# EAGLE design Wireless Flex Node (EAGLE 7.2.0)
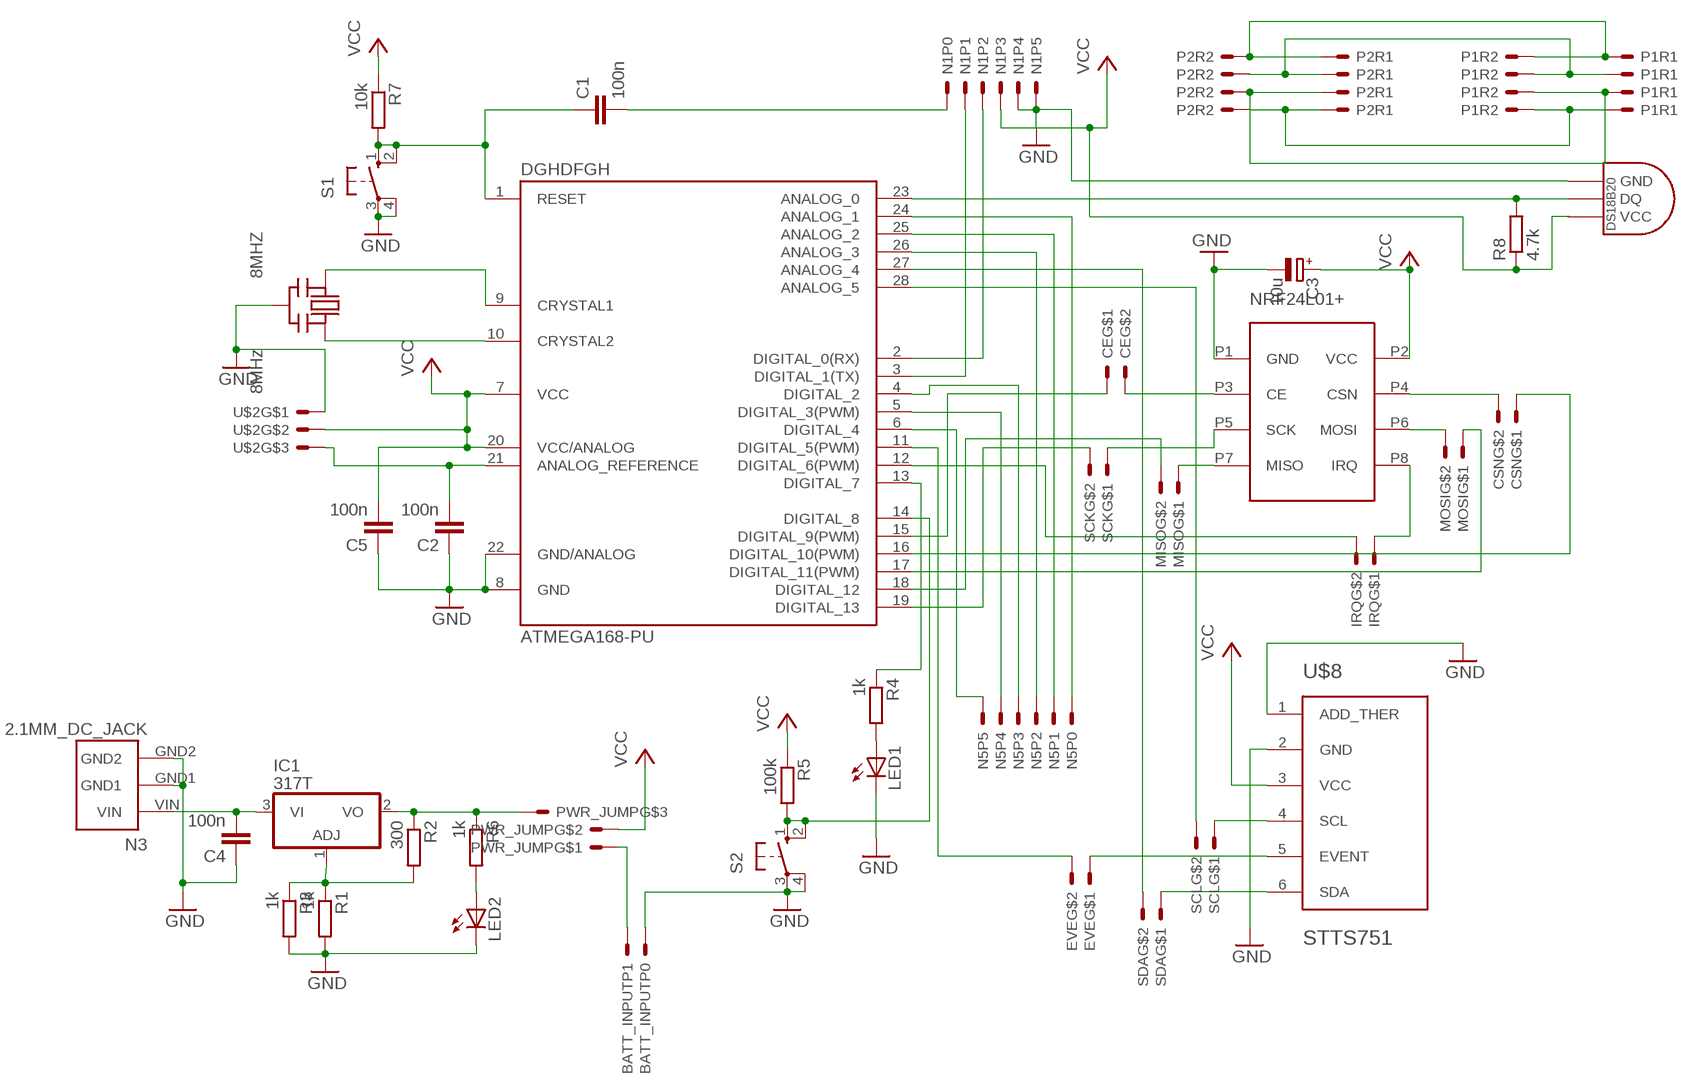
[diagram p0: schematic, sheet 1]

## Parts
8MHZ  8MHz  CERMOSCILL-THM  [CERM_OSC]
BATT_INPUT  2PINHEADER  [2PINHEADER]
C1  100n  C-EU050-030X075  [C050-030X075]
C2  100n  C-EU050-030X075  [C050-030X075]
C3  10u  CPOL-EUE2.5-6  [E2,5-6]
C4  100n  C-EU050-030X075  [C050-030X075]
C5  100n  C-EU050-030X075  [C050-030X075]
CE  2PINHEADER_S  [2PINHEADER_S]
CSN  2PINHEADER_S  [2PINHEADER_S]
DGHDFGH  ATMEGA168-PU  [DIL28-3]
EVE  2PINHEADER_S  [2PINHEADER_S]
IC1  317T  [TO220H]
IRQ  2PINHEADER_S  [2PINHEADER_S]
LED1  LED3MM  [LED3MM]
LED2  LED3MM  [LED3MM]
MISO  2PINHEADER_S  [2PINHEADER_S]
MOSI  2PINHEADER_S  [2PINHEADER_S]
N1  6PINHEADER  [6PINHEADER]
N3  2.1MM_DC_JACK  [2.1MM_DC_JACK]
N5  6PINHEADER  [6PINHEADER]
NRF24L01+  NRF24L01A  [NRF24L01]
P1  2X4_HEADER  [2X4_HEADER]
P2  2X4_HEADER  [2X4_HEADER]
PWR_JUMP  3PINHEADER  [3PINHEADER]
R1  1k  R-EU_0207/10  [0207/10]
R2  300  R-EU_0207/10  [0207/10]
R3  1k  R-EU_0207/10  [0207/10]
R4  1k  R-EU_0207/10  [0207/10]
R5  100k  R-EU_0207/10  [0207/10]
R6  1k  R-EU_0207/10  [0207/10]
R7  10k  R-EU_0207/10  [0207/10]
R8  4.7k  R-EU_0207/10  [0207/10]
S1  10-XX  [B3F-10XX]
S2  10-XX  [B3F-10XX]
SCK  2PINHEADER_S  [2PINHEADER_S]
SCL  2PINHEADER_S  [2PINHEADER_S]
SDA  2PINHEADER_S  [2PINHEADER_S]
U$2  3PINHEADER  [3PINHEADER]
U$8  STTS751  [STTS751-SOT23-6L]
U$9  DS1820TO92  [DS1820]

## Nets
GND: 8MHZ.P$2(GND) BATT_INPUT.P0 C2.1 C3.- C4.1 C5.1 DGHDFGH.8(GND) DGHDFGH.22(GND/ANALOG) LED1.K(C) LED2.K(C) N1.P4 N1.P5 N3.GND1 N3.GND2 NRF24L01+.P1(GND) R1.2 R3.2 S1.3(P) S1.4(P1) S2.3(P) S2.4(P1) U$2.N0 U$8.1(ADD_THER) U$8.2(GND) U$9.GND
N$1: MISO.N0 NRF24L01+.P7(MISO)
N$2: DGHDFGH.18(DIGITAL_12) MISO.N1
N$3: DGHDFGH.19(DIGITAL_13) SCK.N1
N$4: NRF24L01+.P5(SCK) SCK.N0
N$5: MOSI.N1 NRF24L01+.P6(MOSI)
N$6: DGHDFGH.17(DIGITAL_11(PWM)) MOSI.N0
N$7: CE.N1 NRF24L01+.P3(CE)
N$8: CSN.N0 DGHDFGH.16(DIGITAL_10(PWM))
N$9: CSN.N1 NRF24L01+.P4(CSN)
N$10: CE.N0 DGHDFGH.15(DIGITAL_9(PWM))
N$11: DGHDFGH.13(DIGITAL_7) R4.1
N$12: C1.2 N1.P0
N$13: 8MHZ.P$1(IN) DGHDFGH.9(CRYSTAL1)
N$14: 8MHZ.P$3(OUT) DGHDFGH.10(CRYSTAL2)
N$15: C1.1 DGHDFGH.1(RESET) R7.2 S1.1(S) S1.2(S1)
N$16: DGHDFGH.14(DIGITAL_8) R5.2 S2.1(S) S2.2(S1)
N$17: LED1.A R4.2
N$18: IRQ.N0 NRF24L01+.P8(IRQ)
N$19: DGHDFGH.3(DIGITAL_1(TX)) N1.P1
N$20: DGHDFGH.2(DIGITAL_0(RX)) N1.P2
N$21: C2.2 DGHDFGH.21(ANALOG_REFERENCE) U$2.N2
N$22: DGHDFGH.12(DIGITAL_6(PWM)) IRQ.N1
N$23: DGHDFGH.6(DIGITAL_4) N5.P5
N$24: DGHDFGH.23(ANALOG_0) R8.2 U$9.DQ
N$25: DGHDFGH.5(DIGITAL_3(PWM)) N5.P4
N$26: SCL.N0 U$8.4(SCL)
N$27: DGHDFGH.28(ANALOG_5) SCL.N1
N$28: SDA.N0 U$8.6(SDA)
N$29: DGHDFGH.27(ANALOG_4) SDA.N1
N$30: EVE.N0 U$8.5(EVENT)
N$31: DGHDFGH.11(DIGITAL_5(PWM)) EVE.N1
N$32: C4.2 IC1.3(VI) N3.VIN
N$33: IC1.1(ADJ) R1.1 R2.2 R3.1
N$34: IC1.2(VO) PWR_JUMP.N2 R2.1 R6.1
N$35: BATT_INPUT.P1 PWR_JUMP.N0
N$36: LED2.A R6.2
N$37: DGHDFGH.4(DIGITAL_2) N5.P3
N$38: DGHDFGH.26(ANALOG_3) N5.P2
N$39: DGHDFGH.25(ANALOG_2) N5.P1
N$40: DGHDFGH.24(ANALOG_1) N5.P0
N$88: P1.P1(R1:S) P1.P5(R2:S) P2.P1(R1:S) P2.P5(R2:S)
N$89: P1.P2(R1:S1) P1.P6(R2:S1) P2.P2(R1:S1) P2.P6(R2:S1)
N$90: P1.P3(R1:S2) P1.P7(R2:S2) P2.P3(R1:S2) P2.P7(R2:S2)
N$91: P1.P4(R1:S3) P1.P8(R2:S3) P2.P4(R1:S3) P2.P8(R2:S3)
VCC: C3.+ C5.2 DGHDFGH.7(VCC) DGHDFGH.20(VCC/ANALOG) N1.P3 NRF24L01+.P2(VCC) PWR_JUMP.N1 R5.1 R7.1 R8.1 U$2.N1 U$8.3(VCC)

## Power pins joined to a net without a drawn wire
VCC: U$9.VDD(VCC)

## Library data of the parts
8MHZ = adafruit:CERMOSCILL: Ceramic oscillator with built in capacitors such as ZTT-12MHz http://www.ladyada.net/library/eagle
BATT_INPUT = ForceTronics:2PINHEADER
C1 C2 C4 C5 = rcl:C-EU: CAPACITOR, European symbol
C3 = rcl:CPOL-EU: POLARIZED CAPACITOR, European symbol
CE CSN EVE IRQ MISO MOSI SCK SCL SDA = ForceTronics:2PINHEADER_S: 2 pin header with round copper
DGHDFGH = Arduino-AVR:ATMEGA168-PU
IC1 = linear:*317: Positive VOLTAGE REGULATOR
LED1 LED2 = adafruit:LED: LED OSRAM: - CHIPLED LG R971, LG N971, LY N971, LG Q971, LY Q971, LO R971, LY R971 LH N974, LH R974 LS Q976, LO Q976, LY Q976 LO Q996 - Hyper CHIPLED LW Q18S LB Q993, LB Q99A, LB R99A - SideLED LS A670, LO A670, LY A670, LG A670, LP A670 LB A673, LV A673, LT A673, LW A673 LH A674 LY A675 LS A676, LA A676, LO A676, LY A676, LW A676 LS A679, LY A679, LG A679 - Hyper Micro SIDELEDÂ® LS Y876, LA Y876, LO Y876, LY Y876 LT Y87S - SmartLED LW L88C, LW L88S LB L89C, LB L89S, LG L890 LS L89K, LO L89K, LY L89K LS L896, LA L896, LO L896, LY L896 - TOPLED LS T670, LO T670, LY T670, LG T670, LP T670 LSG T670, LSP T670, LSY T670, LOP T670, LYG T670 LG T671, LOG T671, LSG T671 LB T673, LV T673, LT T673, LW T673 LH T674 LS T676, LA T676, LO T676, LY T676, LB T676, LH T676, LSB T676, LW T676 LB T67C, LV T67C, LT T67C, LS T67K, LO T67K, LY T67K, LW E67C LS E67B, LA E67B, LO E67B, LY E67B, LB E67C, LV E67C, LT E67C LW T67C LS T679, LY T679, LG T679 LS T770, LO T770, LY T770, LG T770, LP T770 LB T773, LV T773, LT T773, LW T773 LH T774 LS E675, LA E675, LY E675, LS T675 LS T776, LA T776, LO T776, LY T776, LB T776 LHGB T686 LT T68C, LB T68C - Hyper Mini TOPLEDÂ® LB M676 - Mini TOPLED SantanaÂ® LG M470 LS M47K, LO M47K, LY M47K Source: http://www.osram.convergy.de/
N1 N5 = ForceTronics:6PINHEADER
N3 = ForceTronics:2.1MM_DC_JACK: Male DC Jack 2.1mm
NRF24L01+ = ForceTronics:NRF24L01
P1 P2 = ForceTronics:2X4_HEADER: 2 x 4 Female Pin Header, Spacing is .1"
PWR_JUMP U$2 = ForceTronics:3PINHEADER: 3 pin header with oval copper
R1-R8 = rcl:R-EU_: RESISTOR, European symbol
S1 S2 = switch-omron:10-XX: OMRON SWITCH; MPN: B3F-1000; OC_FARNELL: 176432; OC_NEWARK: 36M3542
U$8 = ForceTronics:STTS751: STTS751 Temperature sensor with SOT23-6L package
U$9 = Ava:DS1820: DS18B20 Programmable Resolution 1-Wire Digital Thermometer Description The DS18B20 digital thermometer provides 9-bit to 12-bit Celsius temperature measurements and has an alarm function with nonvolatile user-programmable upper and lower trigger points. The DS18B20 communicates over a 1-WireÂ® bus that by definition requires only one data line (and ground) for communication with a central microprocessor. It has an operating temperature range of -55Â°C to +125Â°C and is accurate to Â±0.5Â°C over the range of -10Â°C to +85Â°C. In addition, the DS18B20 can derive power directly from the data line ("parasite power"), eliminating the need for an external power supply. Each DS18B20 has a unique 64-bit serial code, which allows multiple DS18B20s to function on the same 1-Wire bus. Thus, it is simple to use one microprocessor to control many DS18B20s distributed over a large area. Applications that can benefit from this feature include HVAC environmental controls, temperature monitoring systems inside buildings, equipment, or machinery, and process monitoring and control systems.

## Board
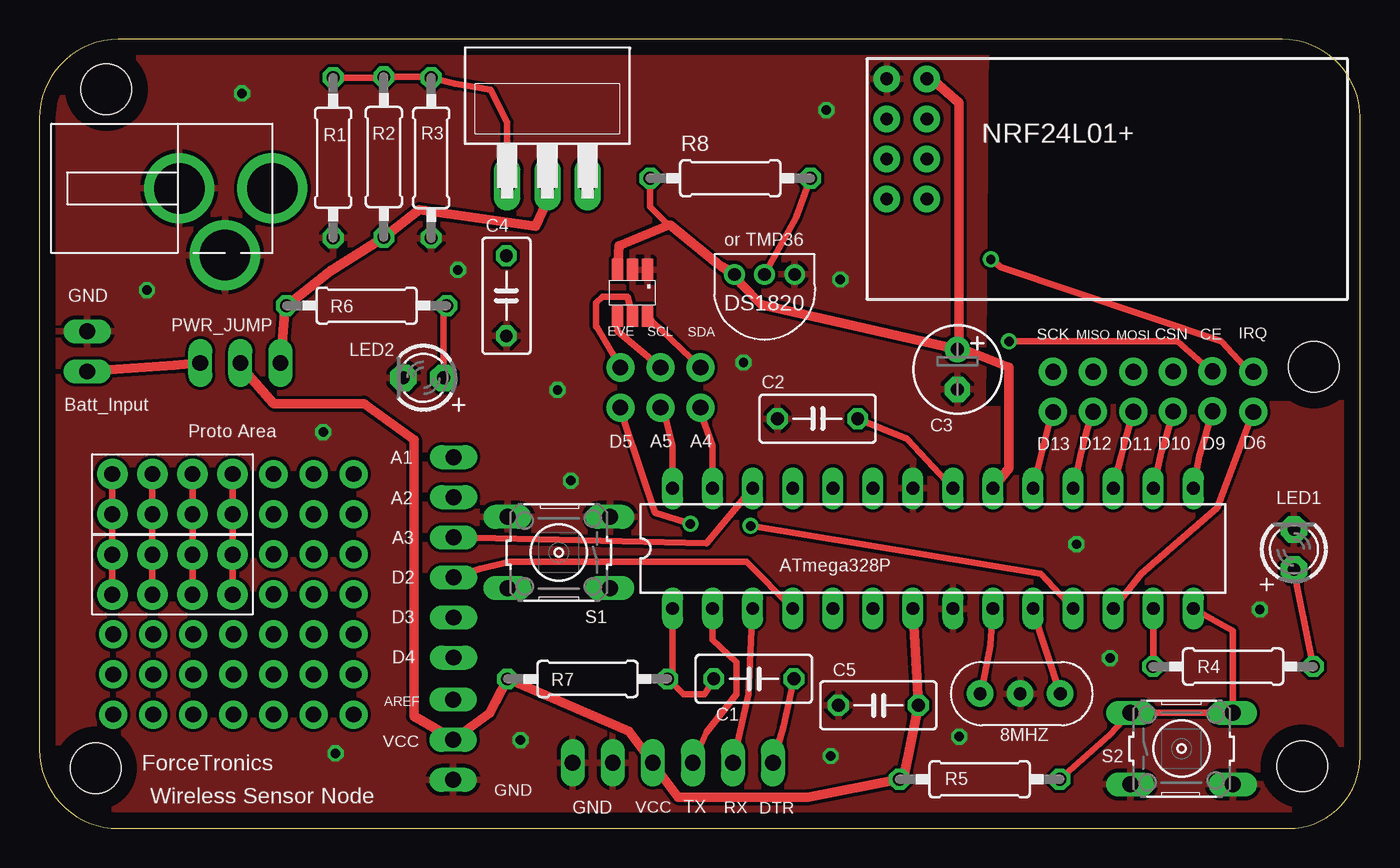
[diagram p1: board, top side]
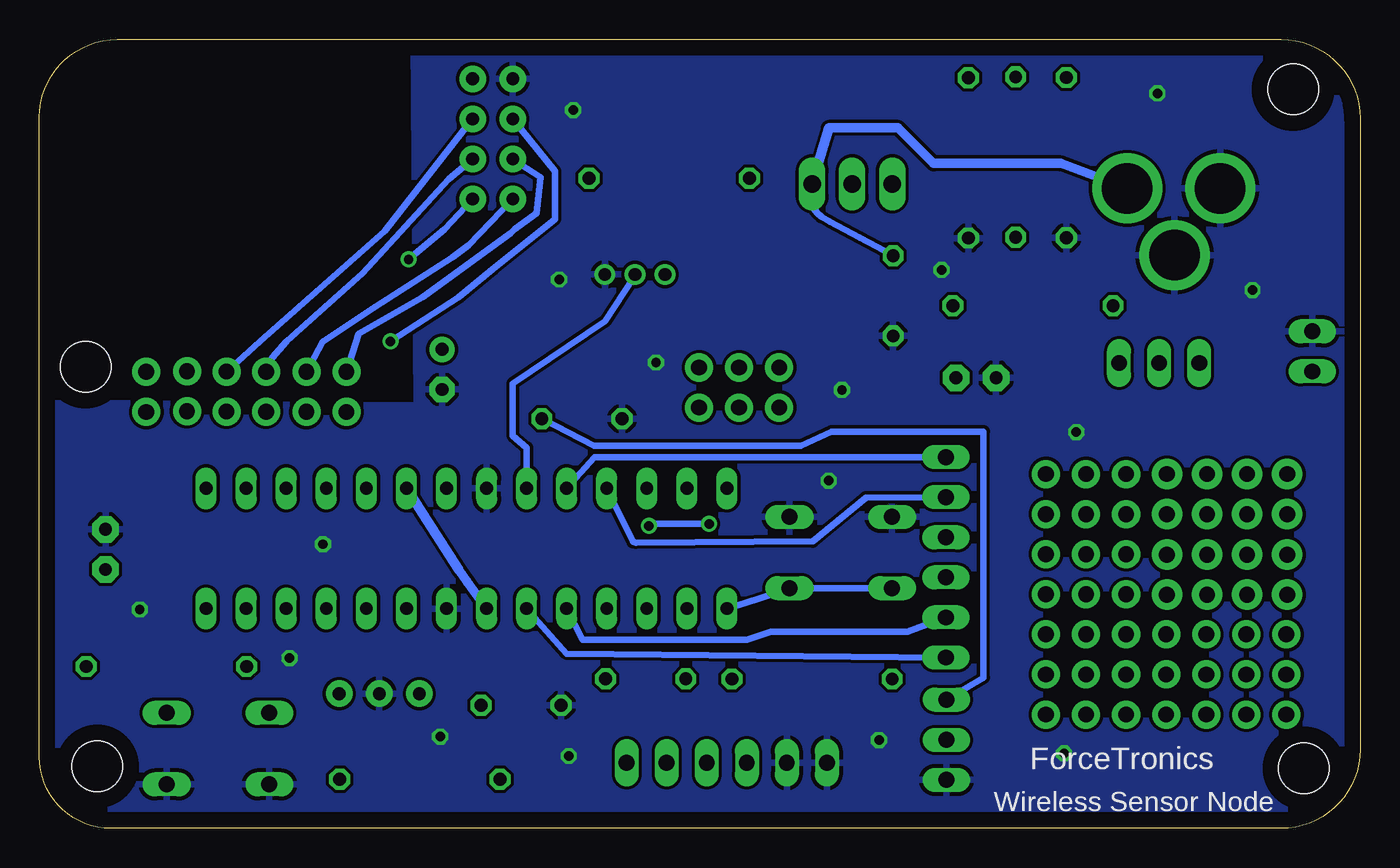
[diagram p2: board, bottom side, seen from below]

Size 83.73 x 50 mm. Coordinates in mm from the lower left corner, seen from the top.
Outline: 0,45 0,5 arc90 5,0 79.2,0 arc90 83.73,4.53 83.73,45.07 arc90 78.8,50 5,50 arc90 0,45
Copper layers (1*16): Top 0.035mm / dielectric 1.5mm / Bottom 0.035mm
Design rules "default": minimum track width 10mil, minimum drill 24mil, track to track 8mil, track to pad 8mil, pad to pad 8mil, via to via 8mil, smd to smd 8mil, copper to edge 40mil, drill to drill 8mil, minimum pad ring 10mil, minimum via ring 8mil, stop-mask expansion 4mil, vias tented up to drill 0mil, thermal gap 10mil
Holes 3.2 mm at 4.24,46.84 3.56,3.81 80.06,3.94 80.8,29.25

### Footprints (pad centres in the part's own frame; a part is rotated, then mirrored left to right if it is on the bottom)
CERM_OSC = drill 0.813 pad 1.676: P$1 -2.54,0; P$2 0,0; P$3 2.54,0
2PINHEADER = drill 1 long: P0 -1.27,0; P1 1.27,0
C050-030X075 = drill 0.813 octagon: 1 -2.54,0; 2 2.54,0
E2,5-6 = drill 0.813 pad 1.6: + -1.27,0 | drill 0.813 pad 1.6 octagon: - 1.27,0
2PINHEADER_S = drill 1 pad 1.778: N0 1.27,2.54; N1 3.81,2.54; N2 1.27,2.54
DIL28-3 = drill 0.813 long: 1 -16.51,-3.81; 2 -13.97,-3.81; 3 -11.43,-3.81; 4 -8.89,-3.81; 5 -6.35,-3.81; 6 -3.81,-3.81; 7 -1.27,-3.81; 8 1.27,-3.81; 9 3.81,-3.81; 10 6.35,-3.81; 11 8.89,-3.81; 12 11.43,-3.81; 13 13.97,-3.81; 14 16.51,-3.81; 15 16.51,3.81; 16 13.97,3.81; 17 11.43,3.81; 18 8.89,3.81; 19 6.35,3.81; 20 3.81,3.81; 21 1.27,3.81; 22 -1.27,3.81; 23 -3.81,3.81; 24 -6.35,3.81; 25 -8.89,3.81; 26 -11.43,3.81; 27 -13.97,3.81; 28 -16.51,3.81
TO220H = drill 1.118 long: 1 -2.54,-10.16; 2 0,-10.16; 3 2.54,-10.16
LED3MM = drill 0.813 pad 1.676 octagon: A -1.27,0; K 1.27,0
6PINHEADER = drill 1 long: P0 1.27,-1.778; P1 3.81,-1.778; P2 6.35,-1.778; P3 8.89,-1.778; P4 11.43,-1.778; P5 13.97,-1.778
2.1MM_DC_JACK = drill 3.2 pad 4.445: GND1 4.1,8.1; GND2 8.327,11; VIN 4.1,14
NRF24L01 = drill 0.8 pad 1.676: P1 13.97,-1.27; P2 13.97,-3.81; P3 11.43,-1.27; P4 11.43,-3.81; P5 8.89,-1.27; P6 8.89,-3.81; P7 6.35,-1.27; P8 6.35,-3.81
2X4_HEADER = drill 1 pad 1.93: P1 1.27,3.81; P2 3.81,3.81; P3 6.35,3.81; P4 8.89,3.81; P5 1.27,1.27; P6 3.81,1.27; P7 6.35,1.27; P8 8.89,1.27
3PINHEADER = drill 1 long: N0 1.27,1.27; N1 3.81,1.27; N2 6.35,1.27
0207/10 = drill 0.813 octagon: 1 -5.08,0; 2 5.08,0
B3F-10XX = drill 1.016 long: 1 -3.251,2.261; 2 3.251,2.261; 3 -3.251,-2.261; 4 3.251,-2.261
STTS751-SOT23-6L = smd 1.4 x 0.7: 1 -0.65,2.4; 2 -0.65,1.45; 3 -0.65,0.5; 4 2.25,0.5; 5 2.25,1.45; 6 2.25,2.4
DS1820 = drill 0.8: DQ 2.54,-1.27; GND 0.635,-1.27; VDD 4.445,-1.27

### Placement (x,y rotation side)
8MHZ  62.18,8.54 0 top
BATT_INPUT  3.02,30.23 270 top
C1  45.29,9.48 0 top
C2  49.33,25.96 0 top
C3  58.2,29.09 270 top
C4  29.61,33.75 90 top
C5  53.19,7.8 0 top
CE  76.91,25.17 90 top
CSN  74.41,25.14 90 top
DGHDFGH  56.65,17.74 0 top
EVE  34.29,30.48 270 top
IC1  32.2,51 0 top
IRQ  74.42,30.2 270 top
LED1  79.54,17.68 90 top
LED2  24.35,28.55 180 top
MISO  64.26,30.21 270 top
MOSI  71.9,25.14 90 top
N1  47.77,2.38 180 top
N3  0.76,44.66 270 top
N5  28.04,24.8 270 top
NRF24L01+  52.46,33.54 90 top
P1  3.35,18.64 0 top
P2  3.35,13.54 0 top
PWR_JUMP  8.93,28.23 0 top
R1  18.62,42.5 270 top
R2  21.84,42.55 90 top
R3  24.84,42.49 270 top
R4  75.68,10.26 0 top
R5  59.61,3.11 0 top
R6  20.74,33.13 0 top
R7  34.75,9.47 0 top
R8  43.8,41.2 0 top
S1  32.93,17.48 180 top
S2  72.41,5.05 0 top
SCK  61.72,30.2 270 top
SCL  36.83,30.48 270 top
SDA  39.37,30.48 270 top
U$2  27.5,1.8 90 top
U$8  36.14,34.75 270 top
U$9  48.51,33.83 180 top

### Tracks (layer width: path | path; a pad name or v marks a point on that pad's centre or on a via)
GND  (via drill 0.6)
  other vias: 18.77,4.75 17.99,25.11 6.81,34.11 12.85,46.58 26.54,35.4 30.5,5.59 33.69,22.03 32.85,27.79 44.64,29.52 50.78,34.78 49.89,45.52 50.17,4.58 58.32,5.82 67.88,10.79 65.75,18.01 77.37,13.87
  pour Bottom: 79,-1 6,-1 arc-90 0,5 0,45 arc-90 5,50 60,50 59.82,26.82 85,27 85,5 arc-90
  pour Top: 85,27 85,0.92 arc-90 80,-1.54 5,0 arc-90 0,5 0,45 arc-90 5,50 60,50 59.82,26.57
GND1  (via drill 1 pad 1.78)
  other vias: 4.67,9.75
GND2  (via drill 1 pad 1.78)
  other vias: 4.67,7.21
N$1
  Bottom 0.406: MISO.N0 65.79,30.85 62.48,33.02 57.53,36.2 56.52,36.96 NRF24L01+.P7
N$2
  Top 0.406: MISO.N1 66.45,25.32 66.05,23.88 DGHDFGH.18
N$3
  Top 0.406: SCK.N1 64.04,25.73 DGHDFGH.19
N$4
  Bottom 0.406: SCK.N0 63.5,31.35 59.44,33.66 53.85,37.72 53.59,37.97 52.2,38.99 51.94,41.27 53.73,42.42 NRF24L01+.P5
N$5
  Bottom 0.406: MOSI.N1 68.96,29.84 68.07,30.86 63.25,35.18 57.78,41.15 56.27,42.42 NRF24L01+.P6
N$6
  Top 0.406: DGHDFGH.17 68.58,23.62 68.86,24.64 MOSI.N0
N$7  (via drill 0.6)
  Top 0.406: CE.N1 74.3,28.98 72.14,30.86 v61.47,30.86
  Bottom 0.406: v61.47,30.86 57.15,33.66 54.99,35.43 51.05,38.61 51.05,41.66 53.73,44.96 NRF24L01+.P3
N$8
  Top 0.406: CSN.N0 71.88,26.41 71.37,24.64 71.13,23.88 DGHDFGH.16
N$9
  Bottom 0.406: CSN.N1 69.72,30.86 61.85,37.85 56.27,44.96 NRF24L01+.P4
N$10
  Top 0.406: DGHDFGH.15 73.53,23.62 73.86,24.64 CE.N0
N$11
  Top 0.406: R4.1 70.62,10.26 DGHDFGH.13
N$12
  Top 0.406: N1.P0 47.17,6.45 C1.2
N$13
  Top 0.406: 8MHZ.P$1 59.69,8.54 60.25,11.4 60.28,11.63 DGHDFGH.9
N$14
  Top 0.406: DGHDFGH.10 62.94,13.98 62.94,13.89 64.72,8.51 8MHZ.P$3
N$15
  Top 0.406: C1.1 42.8,9.48 42.16,8.51 40.84,8.51 R7.2 40.14,9.98 DGHDFGH.1
  Bottom 0.406: DGHDFGH.1 38.13,14.54 S1.1 S1.2
N$16
  Top 0.406: DGHDFGH.14 75.66,12.53 S2.2 S2.1 67.86,5.92 R5.2
N$17
  Top 0.406: R4.2 80.77,10.26 79.88,14.61 79.54,16.38 LED1.A
N$18  (via drill 0.6)
  Top 0.406: IRQ.N0 76.71,28.93 74.93,30.86 60.96,35.56 v60.33,36.07
  Bottom 0.406: v60.33,36.07 58.04,37.97 NRF24L01+.P8
N$19
  Top 0.406: N1.P1 44.97,8.5 DGHDFGH.3
N$20
  Top 0.406: N1.P2 42.29,6.09 42.29,6.1 44.2,8.51 44.2,10.54 42.68,11.94 DGHDFGH.2
N$21
  Top 0.406: C2.2 55,24.69 DGHDFGH.21
  Bottom 0.406: U$2.N2 23.88,9.55 23.88,25.15 33.53,25.15 35.43,24.26 48.57,24.26 C2.2
N$22
  Top 0.406: IRQ.N1 74.68,20.32 69.86,16.13 DGHDFGH.12
N$23
  Bottom 0.406: N5.P5 50.3,11.08 DGHDFGH.6
N$24
  Top 0.406: R8.2 47.98,38.71 U$9.DQ
  Bottom 0.406: U$9.DQ 46.07,34.9 47.88,32.13 53.72,28.19 53.72,24.89 52.84,24.13 DGHDFGH.23
N$25
  Bottom 0.406: N5.P4 26.92,13.11 28.7,12.45 37.34,12.45 38.86,11.94 49.28,11.94 DGHDFGH.5
N$26
  Top 0.406: U$8.4 36.7,32.3 36.58,32.38 36.66,31.5 SCL.N0
N$27
  Top 0.406: SCL.N1 39.75,25.78 40.14,24.26 DGHDFGH.28
N$28
  Top 0.406: U$8.6 38.84,32.14 SDA.N0
N$29
  Top 0.406: SDA.N1 41.94,26.64 42.04,26.04 42.68,24.26 DGHDFGH.27
N$30
  Top 0.406: EVE.N0 35.35,31.76 35.35,31.75 35.3,31.8 35.3,33.3 35.7,33.7 37.29,33.7 U$8.5
N$31  (via drill 0.6)
  Top 0.406: EVE.N1 37.13,25.63 39.04,20.02 v41.27,19.3 | v45.09,19.18 63.51,16.13 DGHDFGH.11
  Bottom 0.406: v41.27,19.3 45.09,19.3 v45.09,19.18
N$32
  Bottom 0.406: C4.2 29.61,36.32 31.71,37.45 33.62,38.46 34.16,38.76 34.4,39 34.8,39.48 IC1.3
  Bottom 0.61: N3.VIN 18.97,42.15 27.05,42.15 29.3,44.4 33.68,44.4 IC1.3
N$33
  Top 0.406: R1.1 21.84,47.58 R2.2 24.84,47.62 R3.1 26.36,47.19 26.95,47.1 28.6,46.8 29.66,44.74 IC1.1
N$34
  Top 0.406: R2.1 | 18.41,35.31 18.58,35.43
  Top 0.61: 18.41,35.31 R2.1 24.08,39.2 31.44,38.16 32.1,39.52 IC1.2 | 18.58,35.43 R6.1 15.53,32.75 PWR_JUMP.N2
N$35
  Top 0.61: BATT_INPUT.P1 8.55,29.34 PWR_JUMP.N0
N$36
  Top 0.406: R6.2 25.62,33.13 LED2.A
N$37
  Top 0.406: N5.P3 27.94,16.46 29.84,16.89 44.84,16.89 DGHDFGH.4
N$38
  Top 0.406: N5.P2 42.3,18.07 DGHDFGH.26
N$39
  Bottom 0.406: DGHDFGH.25 46.11,18.16 45.91,18.11 34.7,18.19 31.34,20.96 N5.P1
N$40
  Bottom 0.406: N5.P0 48.52,23.53 DGHDFGH.24
N$45  (via drill 1 pad 1.78)
  other vias: 14.83,22.45
N$46  (via drill 1 pad 1.78)
  other vias: 17.37,22.45
N$47  (via drill 1 pad 1.78)
  other vias: 19.91,22.45
N$52  (via drill 1 pad 1.78)
  other vias: 14.83,19.91
N$53  (via drill 1 pad 1.78)
  other vias: 17.37,19.91
N$54  (via drill 1 pad 1.78)
  other vias: 19.91,19.91
N$59  (via drill 1 pad 1.78)
  other vias: 14.83,17.37
N$60  (via drill 1 pad 1.78)
  other vias: 17.37,17.37
N$61  (via drill 1 pad 1.78)
  other vias: 19.91,17.37
N$62  (via drill 1 pad 1.78)
  other vias: 19.91,14.83
N$63  (via drill 1 pad 1.78)
  other vias: 17.37,14.83
N$64  (via drill 1 pad 1.78)
  other vias: 14.83,14.83
N$69  (via drill 1 pad 1.78)
  other vias: 4.67,12.29
N$70  (via drill 1 pad 1.78)
  other vias: 7.21,12.29
N$71  (via drill 1 pad 1.78)
  other vias: 9.75,12.29
N$72  (via drill 1 pad 1.78)
  other vias: 12.29,12.29
N$73  (via drill 1 pad 1.78)
  other vias: 14.83,12.29
N$74  (via drill 1 pad 1.78)
  other vias: 17.37,12.29
N$75  (via drill 1 pad 1.78)
  other vias: 19.91,12.29
N$76  (via drill 1 pad 1.78)
  other vias: 19.91,9.75
N$77  (via drill 1 pad 1.78)
  other vias: 17.37,9.75
N$78  (via drill 1 pad 1.78)
  other vias: 14.83,9.75
N$79  (via drill 1 pad 1.78)
  other vias: 12.29,9.75
N$80  (via drill 1 pad 1.78)
  other vias: 9.75,9.75
N$81  (via drill 1 pad 1.78)
  other vias: 7.21,9.75
N$82  (via drill 1 pad 1.78)
  other vias: 19.91,7.21
N$83  (via drill 1 pad 1.78)
  other vias: 17.37,7.21
N$84  (via drill 1 pad 1.78)
  other vias: 14.83,7.21
N$85  (via drill 1 pad 1.78)
  other vias: 12.29,7.21
N$86  (via drill 1 pad 1.78)
  other vias: 9.75,7.21
N$87  (via drill 1 pad 1.78)
  other vias: 7.21,7.21
N$88
  Top 0.406: P1.P1 P1.P5 P2.P1 P2.P5
N$89
  Top 0.406: P1.P2 P1.P6 P2.P2 P2.P6
N$90
  Top 0.406: P1.P3 P1.P7 P2.P3 P2.P7
N$91
  Top 0.406: P1.P4 P1.P8 P2.P4 P2.P8
VCC
  Top 0.406: 26.16,5.71 U$2.N1 | N1.P3 38.91,4.11 | 55.73,7.75 C5.2 | PWR_JUMP.N1 12.57,29.5 | 20.7,26.92 20.57,26.92 | R8.1 38.72,39.41 39.9,38.23
  Top 0.61: 26.16,5.71 23.75,7.11 23.75,24.64 20.57,26.92 14.86,26.92 12.57,29.5 | U$2.N1 28.52,7.29 R7.1 37.39,6.17 N1.P3 | 38.91,4.11 40.49,1.98 48.71,1.98 R5.1 54.84,3.42 55.6,7.16 55.73,7.75 | DGHDFGH.20 61.47,22.82 61.47,29.21 58.29,30.48 | U$8.3 36.74,36.93 39.9,38.23 40.01,38.23 42.96,35.8 43.27,35.6 U$9.VDD 44.47,34.52 45.79,33.2 C3.+ 58.2,30.48 58.29,30.48 | 58.29,30.48 58.29,45.97 56.27,47.75 NRF24L01+.P2 | C5.2 55.71,8.44 DGHDFGH.7
  Bottom 0.61: DGHDFGH.20 59.19,19.56 57.13,16.37 56.6,15.63 DGHDFGH.7

### Text on the board
tNames: or TMP36 | . | GND | Batt_Input | Proto Area | D5 | A5 | A4 | D13 | D12 | D11 | D10 | D9 | D6 | A1 | A2 | A3 | ATmega328P | D2 | D3 | D4 | AREF | VCC | ForceTronics | Wireless Sensor Node | GND | GND | VCC | TX | RX | DTR
bNames: ForceTronics | Wireless Sensor Node